# Altium schematic sheet HUD.SchDoc
size A4
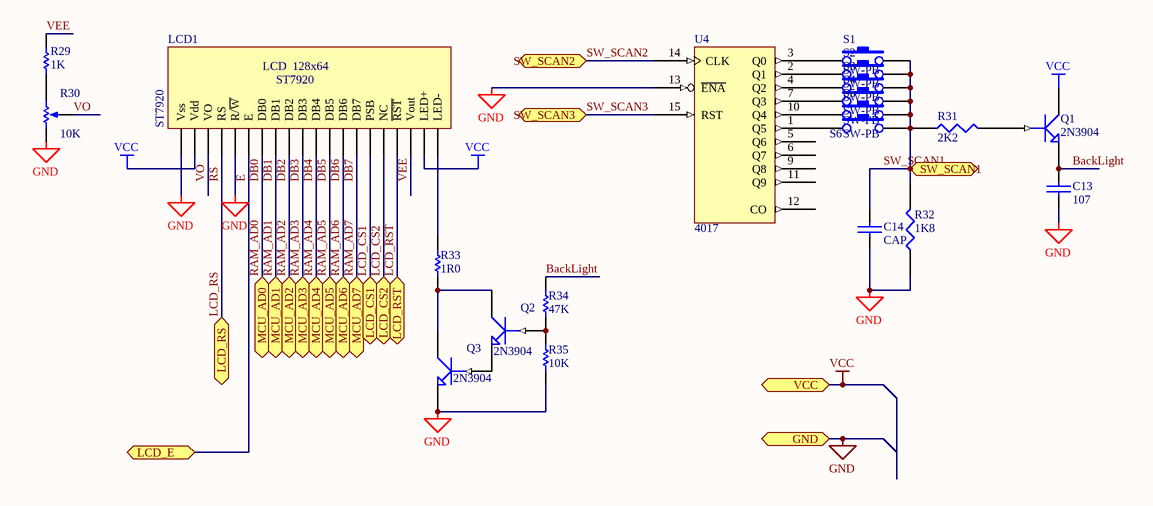
[diagram p0: HUD.SchDoc]

## Parts
C13  107  [SMC_D/WA]
C14  CAP  [6-0805_N]
LCD1  ST7920  [LCD12864B]
Q1  2N3904  [SOT-23]
Q2  2N3904  [SOT-23]
Q3  2N3904  [SOT-23]
R29  1K  [6-0805_N]
R30  10K  [BTXANH]
R31  2K2  [6-0805_N]
R32  1K8  [6-0805_N]
R33  1R0  [6-0805_N]
R34  47K  [6-0805_N]
R35  10K  [6-0805_N]
S1  SW-PB  [CTCHIP_TO]
S2  SW-PB  [CTCHIP_TO]
S3  SW-PB  [CTCHIP_TO]
S4  SW-PB  [CTCHIP_TO]
S5  SW-PB  [CTCHIP_TO]
S6  SW-PB  [CTCHIP_TO]
U4  4017  [SO16]

## Ports
GND, LCD_CS1, LCD_CS2, LCD_E, LCD_RS, LCD_RST, MCU_AD0, MCU_AD1, MCU_AD2, MCU_AD3, MCU_AD4, MCU_AD5, MCU_AD6, MCU_AD7, SW_SCAN1, SW_SCAN2, SW_SCAN3, VCC

## Nets
GND: C13.2 C14.2 LCD1.1(Vss) LCD1.5(R/~{W}) Q3.2(E) R30.1(TOP) R32.1 R35.1 U4.8(GND) U4.13(~{ENA}) ; port GND
VCC: LCD1.2(Vdd) LCD1.19(LED+) Q1.3(C) U4.16(VCC) ; port VCC
BackLight: C13.1 Q1.2(E) R34.2
DB0: LCD1.7(DB0) ; port MCU_AD0  [also labelled RAM_AD0]
DB1: LCD1.8(DB1) ; port MCU_AD1  [also labelled RAM_AD1]
DB2: LCD1.9(DB2) ; port MCU_AD2  [also labelled RAM_AD2]
DB3: LCD1.10(DB3) ; port MCU_AD3  [also labelled RAM_AD3]
DB4: LCD1.11(DB4) ; port MCU_AD4  [also labelled RAM_AD4]
DB5: LCD1.12(DB5) ; port MCU_AD5  [also labelled RAM_AD5]
DB6: LCD1.13(DB6) ; port MCU_AD6  [also labelled RAM_AD6]
DB7: LCD1.14(DB7) ; port MCU_AD7  [also labelled RAM_AD7]
E: LCD1.6(E) ; port LCD_E
LCD_CS1: LCD1.15(PSB) ; port LCD_CS1
LCD_CS2: LCD1.16(NC) ; port LCD_CS2
LCD_RS: LCD1.4(RS) ; port LCD_RS  [also labelled RS]
LCD_RST: LCD1.17(~{RST}) ; port LCD_RST
SW_SCAN1: C14.1 R31.1 R32.2 S1.2 S2.2 S3.2 S4.2 S5.2 S6.2 ; port SW_SCAN1
SW_SCAN2: U4.14(CLK) ; port SW_SCAN2
SW_SCAN3: U4.15(RST) ; port SW_SCAN3
VEE: LCD1.18(Vout) R29.2
VO: LCD1.3(VO) R30.2(TAP)
NetLCD1_20: LCD1.20(LED-) R33.2
NetQ1_1: Q1.1(B) R31.2
NetQ2_1: Q2.1(B) R34.1 R35.2
NetQ2_2: Q2.2(E) Q3.1(B)
NetQ2_3: Q2.3(C) Q3.3(C) R33.1
NetR29_1: R29.1 R30.3(BOT)
NetS1_1: S1.1 U4.3(Q0)
NetS2_1: S2.1 U4.2(Q1)
NetS3_1: S3.1 U4.4(Q2)
NetS4_1: S4.1 U4.7(Q3)
NetS5_1: S5.1 U4.10(Q4)
NetS6_1: S6.1 U4.1(Q5)

Not connected (* = marked no-connect by the designer): U4 5(Q6) 6(Q7) 9(Q8) 11(Q9) 12(CO)

## Notes on the sheet
- (in symbol ST7920) LCD  128x64

## Library data of the parts
C13 C14 = CAP: Capacitor
LCD1 = ST7920: ST7920 LCD128X64
Q1-Q3 = NPN1: NPN Transistor
R29 = Res Semi: Semiconductor Resistor; Value: 470R; Published: 8-Jun-2000; LatestRevisionDate: 17-Jul-2002; LatestRevisionNote: Re-released for DXP Platform.; PackageReference: AXIAL-0.5; Publisher: Altium Limited
R30 = RPot: Potentiometer; Published: *; LatestRevisionDate: *; LatestRevisionNote: *; PackageReference: *; Publisher: *; Sim Note: *; Set Position: *; Value: *
R31 R32 = RES1
R33 = Res Semi: Semiconductor Resistor; Value: 10R; Published: 8-Jun-2000; LatestRevisionDate: 17-Jul-2002; LatestRevisionNote: Re-released for DXP Platform.; PackageReference: AXIAL-0.5; Publisher: Altium Limited
R34 = Res Semi: Semiconductor Resistor; Value: 2K2; Published: 8-Jun-2000; LatestRevisionDate: 17-Jul-2002; LatestRevisionNote: Re-released for DXP Platform.; PackageReference: AXIAL-0.5; Publisher: Altium Limited
R35 = Res Semi: Semiconductor Resistor; Published: 8-Jun-2000; LatestRevisionDate: 17-Jul-2002; LatestRevisionNote: Re-released for DXP Platform.; PackageReference: AXIAL-0.5; Publisher: Altium Limited; Value: 10K